# EAGLE design PentaFnord_LedBoard_0_91 (EAGLE 5.12)
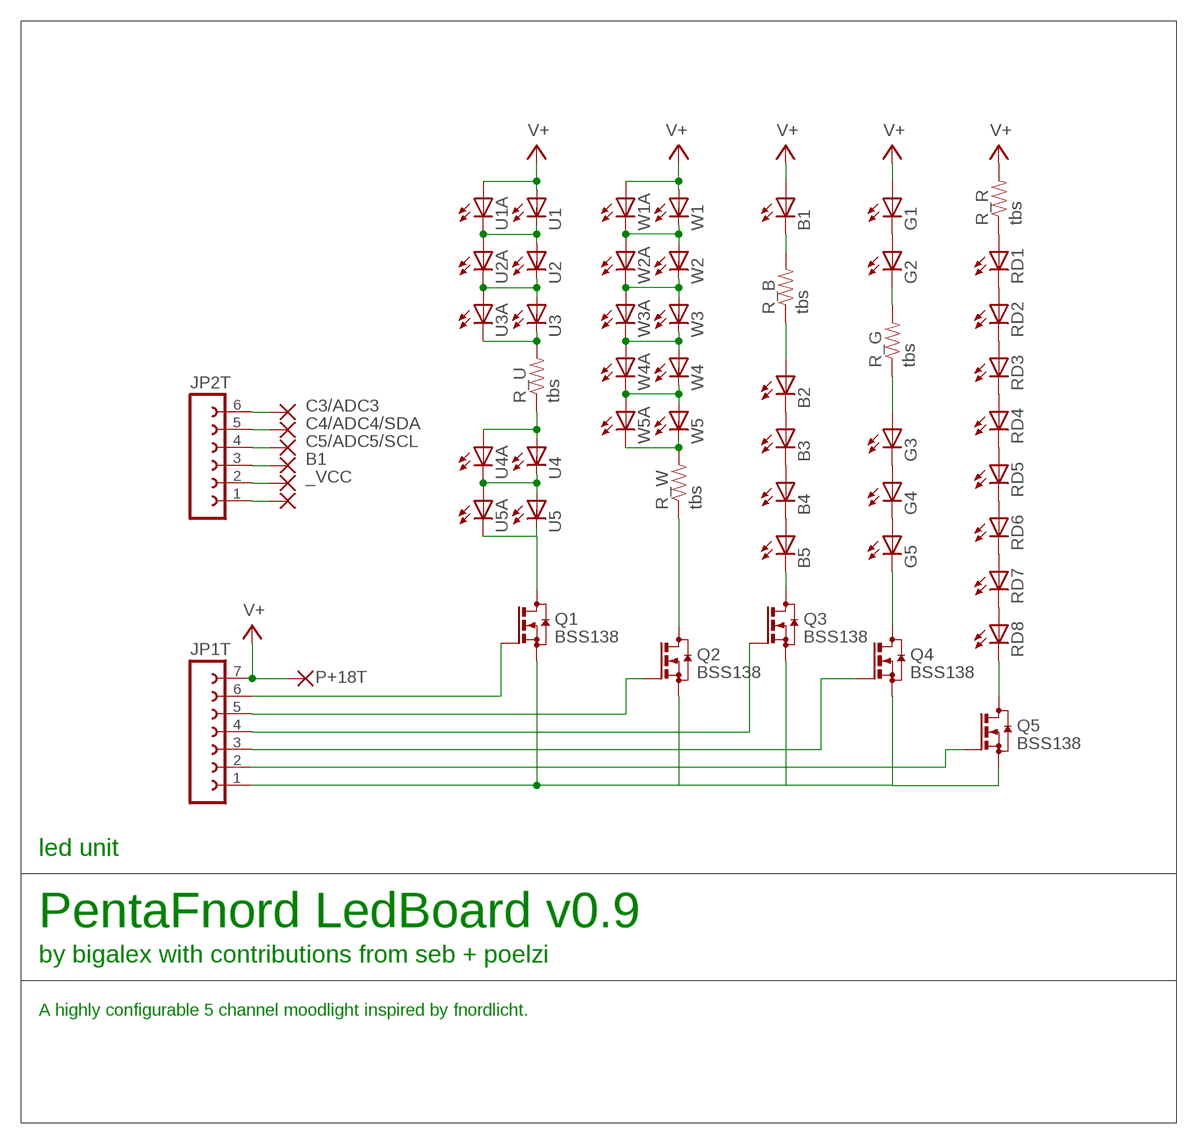
[diagram p0: schematic, sheet 1]

## Parts
B1  LED5MM  [LED5MM]
B2  LED5MM  [LED5MM]
B3  LED5MM  [LED5MM]
B4  LED5MM  [LED5MM]
B5  LED5MM  [LED5MM]
G1  LED5MM  [LED5MM]
G2  LED5MM  [LED5MM]
G3  LED5MM  [LED5MM]
G4  LED5MM  [LED5MM]
G5  LED5MM  [LED5MM]
JP1T  FE07-1  [FE07]
JP2T  FE06-1  [FE06]
P+5T  WIREPAD2,54/0,8  [2,54/0,8]
P+18T  WIREPAD2,54/0,8  [2,54/0,8]
PB1T  WIREPAD2,54/0,8  [2,54/0,8]
PC3T  WIREPAD2,54/0,8  [2,54/0,8]
PC4T  WIREPAD2,54/0,8  [2,54/0,8]
PC5T  WIREPAD2,54/0,8  [2,54/0,8]
PGNDT1  WIREPAD2,54/0,8  [2,54/0,8]
Q1  BSS138  BSS123  [SOT23]
Q2  BSS138  BSS123  [SOT23]
Q3  BSS138  BSS123  [SOT23]
Q4  BSS138  BSS123  [SOT23]
Q5  BSS138  BSS123  [SOT23]
R_B  tbs  RESISTOR1206  [1206]
R_G  tbs  RESISTOR1206  [1206]
R_R  tbs  RESISTOR1206  [1206]
R_U  tbs  RESISTOR1206  [1206]
R_W  tbs  RESISTOR1206  [1206]
RD1  LED5MM  [LED5MM]
RD2  LED5MM  [LED5MM]
RD3  LED5MM  [LED5MM]
RD4  LED5MM  [LED5MM]
RD5  LED5MM  [LED5MM]
RD6  LED5MM  [LED5MM]
RD7  LED5MM  [LED5MM]
RD8  LED5MM  [LED5MM]
U1  NICHIA_NSSL157T-H3  LED_PLCC2  [PLCC2]
U1A  LED5MM  [LED5MM]
U2  NICHIA_NSSL157T-H3  LED_PLCC2  [PLCC2]
U2A  LED5MM  [LED5MM]
U3  NICHIA_NSSL157T-H3  LED_PLCC2  [PLCC2]
U3A  LED5MM  [LED5MM]
U4  NICHIA_NSSL157T-H3  LED_PLCC2  [PLCC2]
U4A  LED5MM  [LED5MM]
U5  NICHIA_NSSL157T-H3  LED_PLCC2  [PLCC2]
U5A  LED5MM  [LED5MM]
W1  NICHIA_NSSL157T-H3  [NICHIA_NSSL157T-H3]
W1A  LED5MM  [LED5MM]
W2  NICHIA_NSSL157T-H3  [NICHIA_NSSL157T-H3]
W2A  LED5MM  [LED5MM]
W3  NICHIA_NSSL157T-H3  [NICHIA_NSSL157T-H3]
W3A  LED5MM  [LED5MM]
W4  NICHIA_NSSL157T-H3  [NICHIA_NSSL157T-H3]
W4A  LED5MM  [LED5MM]
W5  NICHIA_NSSL157T-H3  [NICHIA_NSSL157T-H3]
W5A  LED5MM  [LED5MM]

## Nets
_VCC: JP2T.2 P+5T.1(P)
B1: JP2T.3 PB1T.1(P)
C3/ADC3: JP2T.6 PC3T.1(P)
C4/ADC4/SDA: JP2T.5 PC4T.1(P)
C5/ADC5/SCL: JP2T.4 PC5T.1(P)
GND_T: JP1T.1 JP2T.1 PGNDT1.1(P) Q1.2(S) Q2.2(S) Q3.2(S) Q4.2(S) Q5.2(S)
N$1: B5.K(C) Q3.3(D)
N$2: W4.K@1(C) W4A.K(C) W5.A@2(A) W5A.A
N$3: U1.P$1(C) U1A.K(C) U2.P$2(A) U2A.A
N$4: G5.K(C) Q4.3(D)
N$5: R_U.2 U3.P$1(C) U3A.K(C)
N$6: Q1.3(D) U5.P$1(C) U5A.K(C)
N$7: Q2.3(D) R_W.1
N$8: W3.K@1(C) W3A.K(C) W4.A@2(A) W4A.A
N$9: B1.K(C) R_B.2
N$10: U2.P$1(C) U2A.K(C) U3.P$2(A) U3A.A
N$11: B2.A R_B.1
N$12: U4.P$1(C) U4A.K(C) U5.P$2(A) U5A.A
N$13: G1.K(C) G2.A
N$14: G2.K(C) R_G.2
N$15: G3.K(C) G4.A
N$16: G4.K(C) G5.A
N$17: B2.K(C) B3.A
N$18: B3.K(C) B4.A
N$19: B4.K(C) B5.A
N$20: G3.A R_G.1
N$21: RD1.K(C) RD2.A
N$22: RD2.K(C) RD3.A
N$23: RD3.K(C) RD4.A
N$24: RD4.K(C) RD5.A
N$25: RD5.K(C) RD6.A
N$26: RD6.K(C) RD7.A
N$27: R_R.1 RD1.A
N$28: RD7.K(C) RD8.A
N$29: R_U.1 U4.P$2(A) U4A.A
N$30: Q5.3(D) RD8.K(C)
N$31: R_W.2 W5.K@1(C) W5A.K(C)
N$34: W2.K@1(C) W2A.K(C) W3.A@2(A) W3A.A
N$39: JP1T.6 Q1.1(G)
N$40: JP1T.5 Q2.1(G)
N$41: JP1T.3 Q4.1(G)
N$42: JP1T.4 Q3.1(G)
N$43: JP1T.2 Q5.1(G)
N$54: W1.K@1(C) W1A.K(C) W2.A@2(A) W2A.A
V+: B1.A G1.A JP1T.7 P+18T.1(P) R_R.2 U1.P$2(A) U1A.A W1.A@2(A) W1A.A

## Notes on the sheet
- led unit
- PentaFnord LedBoard v0.9
- by bigalex with contributions from seb + poelzi
- A highly configurable 5 channel moodlight inspired by fnordlicht.

## Library data of the parts
B1-B5 G1-G5 RD1-RD8 U1A U2A U3A U4A U5A W1A W2A W3A W4A W5A = Alex_personal:LED: LED OSRAM: - CHIPLED LG R971, LG N971, LY N971, LG Q971, LY Q971, LO R971, LY R971 LH N974, LH R974 LS Q976, LO Q976, LY Q976 LO Q996 - Hyper CHIPLED LW Q18S LB Q993, LB Q99A, LB R99A - SideLED LS A670, LO A670, LY A670, LG A670, LP A670 LB A673, LV A673, LT A673, LW A673 LH A674 LY A675 LS A676, LA A676, LO A676, LY A676, LW A676 LS A679, LY A679, LG A679 - Hyper Micro SIDELED® LS Y876, LA Y876, LO Y876, LY Y876 LT Y87S - SmartLED LW L88C, LW L88S LB L89C, LB L89S, LG L890 LS L89K, LO L89K, LY L89K LS L896, LA L896, LO L896, LY L896 - TOPLED LS T670, LO T670, LY T670, LG T670, LP T670 LSG T670, LSP T670, LSY T670, LOP T670, LYG T670 LG T671, LOG T671, LSG T671 LB T673, LV T673, LT T673, LW T673 LH T674 LS T676, LA T676, LO T676, LY T676, LB T676, LH T676, LSB T676, LW T676 LB T67C, LV T67C, LT T67C, LS T67K, LO T67K, LY T67K, LW E67C LS E67B, LA E67B, LO E67B, LY E67B, LB E67C, LV E67C, LT E67C LW T67C LS T679, LY T679, LG T679 LS T770, LO T770, LY T770, LG T770, LP T770 LB T773, LV T773, LT T773, LW T773 LH T774 LS E675, LA E675, LY E675, LS T675 LS T776, LA T776, LO T776, LY T776, LB T776 LHGB T686 LT T68C, LB T68C - Hyper Mini TOPLED® LB M676 - Mini TOPLED Santana® LG M470 LS M47K, LO M47K, LY M47K Source: http://www.osram.convergy.de LUXEON: - LUMILED® LXK2-PW12-R00, LXK2-PW12-S00, LXK2-PW14-U00, LXK2-PW14-V00 LXK2-PM12-R00, LXK2-PM12-S00, LXK2-PM14-U00 LXK2-PE12-Q00, LXK2-PE12-R00, LXK2-PE12-S00, LXK2-PE14-T00, LXK2-PE14-U00 LXK2-PB12-K00, LXK2-PB12-L00, LXK2-PB12-M00, LXK2-PB14-N00, LXK2-PB14-P00, LXK2-PB14-Q00 LXK2-PR12-L00, LXK2-PR12-M00, LXK2-PR14-Q00, LXK2-PR14-R00 LXK2-PD12-Q00, LXK2-PD12-R00, LXK2-PD12-S00 LXK2-PH12-R00, LXK2-PH12-S00 LXK2-PL12-P00, LXK2-PL12-Q00, LXK2-PL12-R00 Source: www.luxeon.com KINGBRIGHT: KA-3528ASYC Source: www.kingbright.com
JP1T = con-lsta:FE07-1: FEMALE HEADER; OC_FARNELL: unknown; OC_NEWARK: unknown
JP2T = con-lsta:FE06-1: FEMALE HEADER; OC_FARNELL: unknown; OC_NEWARK: unknown
P+5T P+18T PB1T PC3T PC4T PC5T PGNDT1 = wirepad:WIREPAD: Wire PAD connect wire on PCB
Q1-Q5 = transistor-small-signal:BSS123: N-CHANNEL MOS FET
R_B R_G R_R R_U R_W = SparkFun:RESISTOR: Resistor Basic schematic elements and footprints for 0603, 1206, and PTH resistors.
U1-U5 = seb:LED_PLCC2
W1-W5 = seb:NICHIA_NSSL157T-H3

## Board
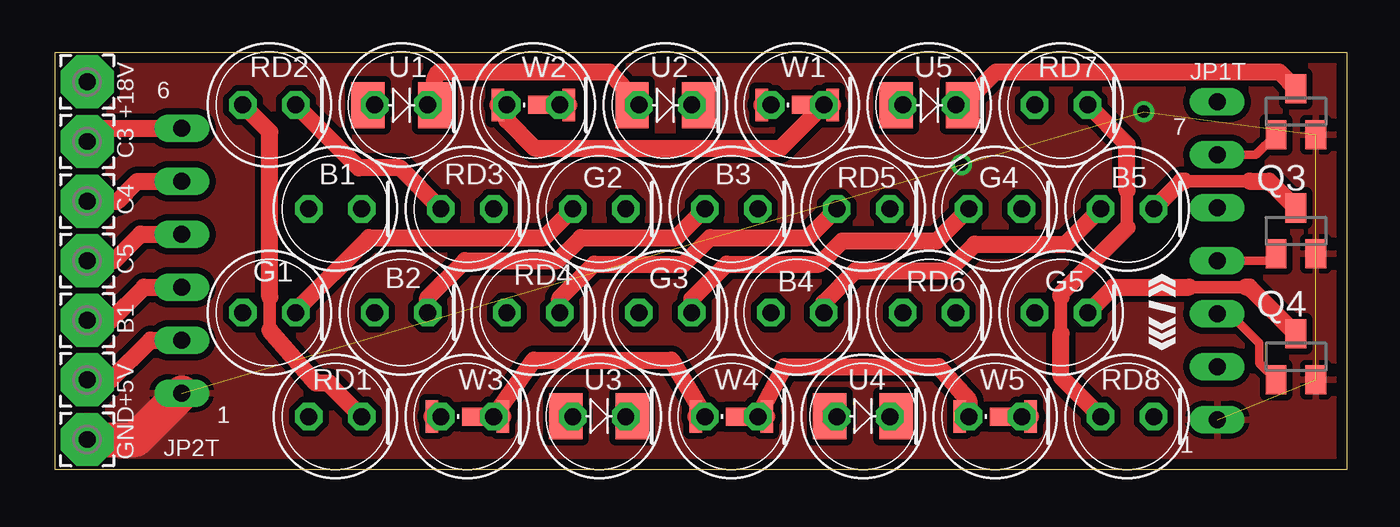
[diagram p1: board, top side]
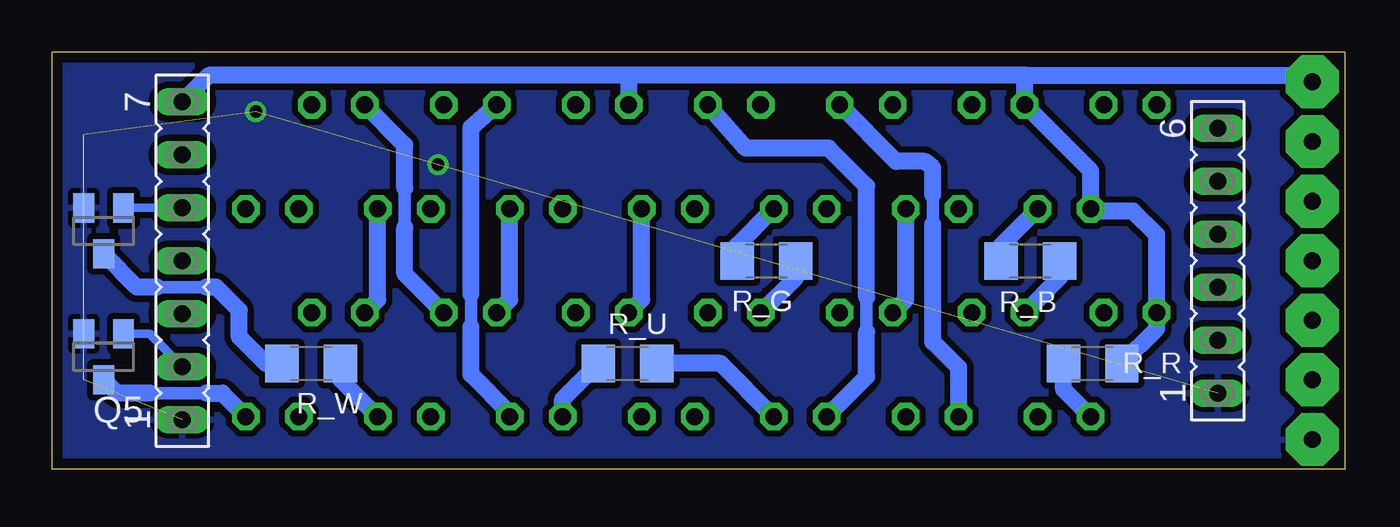
[diagram p2: board, bottom side, seen from below]

Size 62 x 20 mm. Coordinates in mm from the lower left corner, seen from the top.
Outline: 0,0 62,0 62,20 0,20 0,0
Copper layers (1*16): Top 0.035mm / dielectric 1.5mm / Bottom 0.035mm
Design rules "default *": minimum track width 12mil, minimum drill 0.4mm, track to track 10mil, track to pad 10mil, pad to pad 8mil, via to via 10mil, smd to smd 8mil, copper to edge 20mil, drill to drill 8mil, minimum pad ring 10mil, minimum via ring 8mil, stop-mask expansion 4mil, vias tented up to drill 40mil, thermal gap 10mil

### Footprints (pad centres in the part's own frame; a part is rotated, then mirrored left to right if it is on the bottom)
LED5MM = drill 0.813 octagon: A -1.27,0; K 1.27,0
FE07 = drill 0.813 long: 1 -7.62,0; 2 -5.08,0; 3 -2.54,0; 4 0,0; 5 2.54,0; 6 5.08,0; 7 7.62,0
FE06 = drill 0.813 long: 1 -6.35,0; 2 -3.81,0; 3 -1.27,0; 4 1.27,0; 5 3.81,0; 6 6.35,0
2,54/0,8 = drill 0.813 pad 2.54 octagon: 1 0,0
SOT23 = smd 1 x 1.4: 1 -0.95,-1.1; 2 0.95,-1.1; 3 0,1.1
1206 = smd 1.6 x 1.8: 1 -1.4,0; 2 1.4,0
PLCC2 = smd 1.6 x 2.2: P$1 -1.6,0; P$2 1.6,0
NICHIA_NSSL157T-H3 = smd 0.64 x 0.86: A@1 1.08,0 | smd 0.6 x 1.55: A@2 1.7,0; K@1 -1.7,0 | smd 1.66 x 0.86: K@2 -0.57,0

### Placement (x,y rotation side)
B1  13.46,12.49 0 top
B2  16.63,7.51 0 top
B3  32.45,12.49 0 top
B4  35.62,7.51 0 top
B5  51.44,12.49 0 top
G1  10.3,7.51 0 top
G2  26.12,12.49 0 top
G3  29.29,7.51 0 top
G4  45.11,12.49 0 top
G5  48.28,7.51 0 top
JP1T  55.75,10 90 bottom
JP2T  6.1,10 90 bottom
P+5T  1.56,4.29 0 top
P+18T  1.56,18.57 0 top
PB1T  1.56,7.14 0 top
PC3T  1.56,15.72 0 top
PC4T  1.56,12.86 0 top
PC5T  1.56,10 0 top
PGNDT1  1.56,1.43 0 top
Q1  59.53,17.14 0 top
Q2  59.53,11.43 180 bottom
Q3  59.53,11.43 0 top
Q4  59.53,5.4 0 top
Q5  59.53,5.4 180 bottom
R_B  15.08,9.98 180 bottom
R_G  27.73,9.98 180 bottom
R_R  12.1,5.08 0 bottom
R_U  34.4,5.08 0 bottom
R_W  49.58,5.08 0 bottom
RD1  13.46,2.53 0 top
RD2  10.3,17.47 0 top
RD3  19.79,12.49 0 top
RD4  22.96,7.51 0 top
RD5  38.78,12.49 0 top
RD6  41.95,7.51 0 top
RD7  48.28,17.47 0 top
RD8  51.44,2.53 0 top
U1  16.63,17.45 180 top
U1A  16.63,17.47 0 top
U2  29.29,17.46 180 top
U2A  29.29,17.47 0 top
U3  26.11,2.55 180 top
U3A  26.12,2.53 0 top
U4  38.77,2.55 180 top
U4A  38.78,2.53 0 top
U5  41.95,17.46 180 top
U5A  41.95,17.47 0 top
W1  35.62,17.47 180 top
W1A  35.62,17.47 0 top
W2  22.96,17.47 180 top
W2A  22.96,17.47 0 top
W3  19.79,2.53 180 top
W3A  19.79,2.53 0 top
W4  32.45,2.53 180 top
W4A  32.45,2.53 0 top
W5  45.11,2.53 180 top
W5A  45.11,2.53 0 top

### Tracks (layer width: path | path; a pad name or v marks a point on that pad's centre or on a via)
_VCC
  Top 0.813: JP2T.2 4.6,6.19 2.7,4.29 P+5T.1
B1
  Top 0.813: JP2T.3 4.29,8.73 2.7,7.14 PB1T.1
C3/ADC3
  Top 0.813: JP2T.6 2.19,16.35 PC3T.1
C4/ADC4/SDA
  Top 0.813: JP2T.5 3.97,13.81 3.02,12.86 PC4T.1
C5/ADC5/SCL
  Top 0.813: JP2T.4 4.13,11.27 2.86,10 PC5T.1
GND_T  (via drill 0.6)  (8 unrouted)
  Top 1.676: JP2T.1 3.88,1.43 PGNDT1.1
  other vias: 43.5,14.61 52.23,17.14
  pour Bottom (isolate 0.305): 0,20 62,20 62,0 0,0
  pour Top (isolate 0.305): 0,20 62,20 62,0 0,0
N$1
  Top 0.61: 54.19,13.81 57.3,13.81
  Top 0.813: 54.19,13.81 54.03,13.81 B5.K | 57.3,13.81 58.25,13.81 Q3.3
N$2
  Top 0.305: W5A.A W5.A@2
  Top 0.813: W5A.A 43.84,3.31 43.3,3.91 42.39,4.92 35,4.92 W4A.K W4.K@1
N$3
  Top 0.813: U1A.K U1.P$1 18.23,18.7 18.42,19.05 26.6,19.05 U2A.A U2.P$2
N$4
  Top 0.61: 54.42,8.73 57.14,8.73
  Top 0.813: 54.42,8.73 50.77,8.73 G5.K | 57.14,8.73 57.3,8.73 Q4.3
N$5
  Top 0.813: U3A.K U3.P$1
  Bottom 0.813: U3A.K 29.94,5.08 R_U.2
N$6
  Top 0.813: U5A.K U5.P$1 45.15,19.05 58.73,19.05 Q1.3
N$7
  Bottom 0.61: 54.61,8.73 56.98,8.73
  Bottom 0.813: 56.98,8.73 57.93,8.73 Q2.3 | 54.61,8.73 54.13,8.73 53.02,7.62 53.02,6.35 51.75,5.08 R_W.1
N$8
  Top 0.813: W3.K@1 W3A.K 22.98,5.24 29.58,5.24 W4A.A W4.A@2
N$9
  Bottom 0.813: B1.K 16.48,10.74 R_B.2
N$10
  Top 0.813: U3A.A U3.P$2 | U2A.K U2.P$1
  Bottom 0.61: 22.94,6.59 22.94,8.26
  Bottom 0.813: U2A.K 28.73,15.4 24.76,15.4 22.94,13.57 22.94,8.26 | 22.94,6.59 22.94,4.44 U3A.A
N$11
  Bottom 0.813: R_B.1 13.68,9.19 B2.A
N$12
  Top 0.406: U5A.A U5.P$2
  Top 0.813: U4A.K U4.P$1
  Bottom 0.61: 41.91,6.83 41.91,8.41
  Bottom 0.813: U5A.A 41.91,16.4 41.91,8.41 | 41.91,6.83 41.91,4.55 40.05,2.69 U4A.K
N$13
  Top 0.813: G2.A 23.47,11.11 15.08,11.11 11.57,7.6 G1.K
N$14
  Bottom 0.813: G2.K 29.13,10.75 R_G.2
N$15
  Top 0.813: G4.A 42.31,10.95 37.78,10.95 36.67,9.84 32.23,9.84 30.56,8.17 G3.K
N$16
  Bottom 0.813: G4.K 46.38,8.13 G5.A
N$17
  Top 0.813: B3.A 29.8,11.11 25.24,11.11 24.13,10 19.68,10 17.9,8.21 B2.K
N$18
  Bottom 0.813: B3.K 33.72,8.13 B4.A
N$19
  Top 0.813: B5.A 48.48,10.79 44.13,10.79 42.86,9.53 38.42,9.53 36.89,8 B4.K
N$20
  Bottom 0.813: R_G.1 26.33,9.19 G3.A
N$21
  Top 0.61: 10.32,6.67 10.32,8.26
  Top 0.813: RD2.A 10.32,16.18 10.32,8.26 | 10.32,6.67 12.54,4.13 13.18,4.13 13.18,4.09 RD1.K
N$22
  Top 0.813: RD2.K 14.59,14.45 16.57,14.45 RD3.A
N$23
  Bottom 0.813: RD3.K 21.06,8.13 RD4.A
N$24
  Top 0.813: RD5.A 36.13,11.11 31.43,11.11 30.16,9.84 25.88,9.84 24.23,8.19 RD4.K
N$25
  Bottom 0.813: RD5.K 40.05,8.13 RD6.A
N$26
  Bottom 0.61: 45.09,11.59 45.09,13.49
  Bottom 0.813: RD6.K 45.09,9.38 45.09,11.59 | 45.09,13.49 45.09,15.55 RD7.A
N$27
  Bottom 0.813: R_R.1 13.5,3.83 RD1.A
N$28
  Top 0.61: 48.26,6.51 48.26,8.26 | 51.44,11.59 51.44,13.36
  Top 0.813: 48.26,6.51 48.26,4.44 RD8.A | 48.26,8.26 48.26,8.41 51.44,11.59 | 51.44,13.36 51.44,15.58 RD7.K
N$29
  Top 0.813: U4A.A U4.P$2
  Bottom 0.813: R_U.1 37.51,3.37 U4A.A
N$30
  Bottom 0.61: 54.61,3.65 57.3,3.65
  Bottom 0.813: 57.3,3.65 58.89,3.65 Q5.3 | 54.61,3.65 53.83,3.65 RD8.K
N$31
  Top 0.813: W5.K@1 W5A.K
  Bottom 0.813: W5A.K 48.18,4.33 R_W.2
N$34
  Top 0.813: W3A.A W3.A@2 | W2A.K W2.K@1
  Bottom 0.61: 19.76,11.75 19.76,13.18
  Bottom 0.813: W3A.A 18.52,4.87 19.76,6.11 19.76,11.75 | 19.76,13.18 19.76,14.45 20.16,14.76 21.52,14.76 W2A.K
N$39
  Top 0.406: JP1T.6 57.62,15.08 Q1.1
N$40
  Bottom 0.406: JP1T.5 55.76,12.53 Q2.1
N$41
  Top 0.406: JP1T.3 56.36,7.46 57.78,6.03 57.78,5.09 Q4.1
N$42
  Top 0.406: JP1T.4 58.25,10 Q3.1
N$43
  Bottom 0.406: JP1T.2 57.33,6.5 Q5.1
N$54
  Top 0.813: W1.K@1 W1A.K 34.82,15.4 23.02,15.4 21.69,16.73 W2A.A W2.A@2
V+
  Top 0.406: U1A.A U1.P$2
  Top 0.813: W1A.A W1.A@2
  Bottom 0.813: JP1T.7 54.48,18.89 34.29,18.89 | 15.24,18.89 1.71,18.89 arc90 P+18T.1 | 15.24,18.89 arc-90 15.36,18.77 U1A.A 12.19,14.3 B1.A 12.08,12.38 10.16,12.38 9.03,11.25 G1.A 9.03,6.75 R_R.2 | 15.24,18.89 34.29,18.89 | W1A.A 34.35,18.83 34.29,18.89

### Text on the board
tNames: 6 | +18V | 7 | C3 | C4 | C5 | B1 | +5V | 1 | 1 | GND
bStop: PentaFnord | LedBoard 0.91